# Altium project WarmAndFuzzy Thermostat.PrjPcb
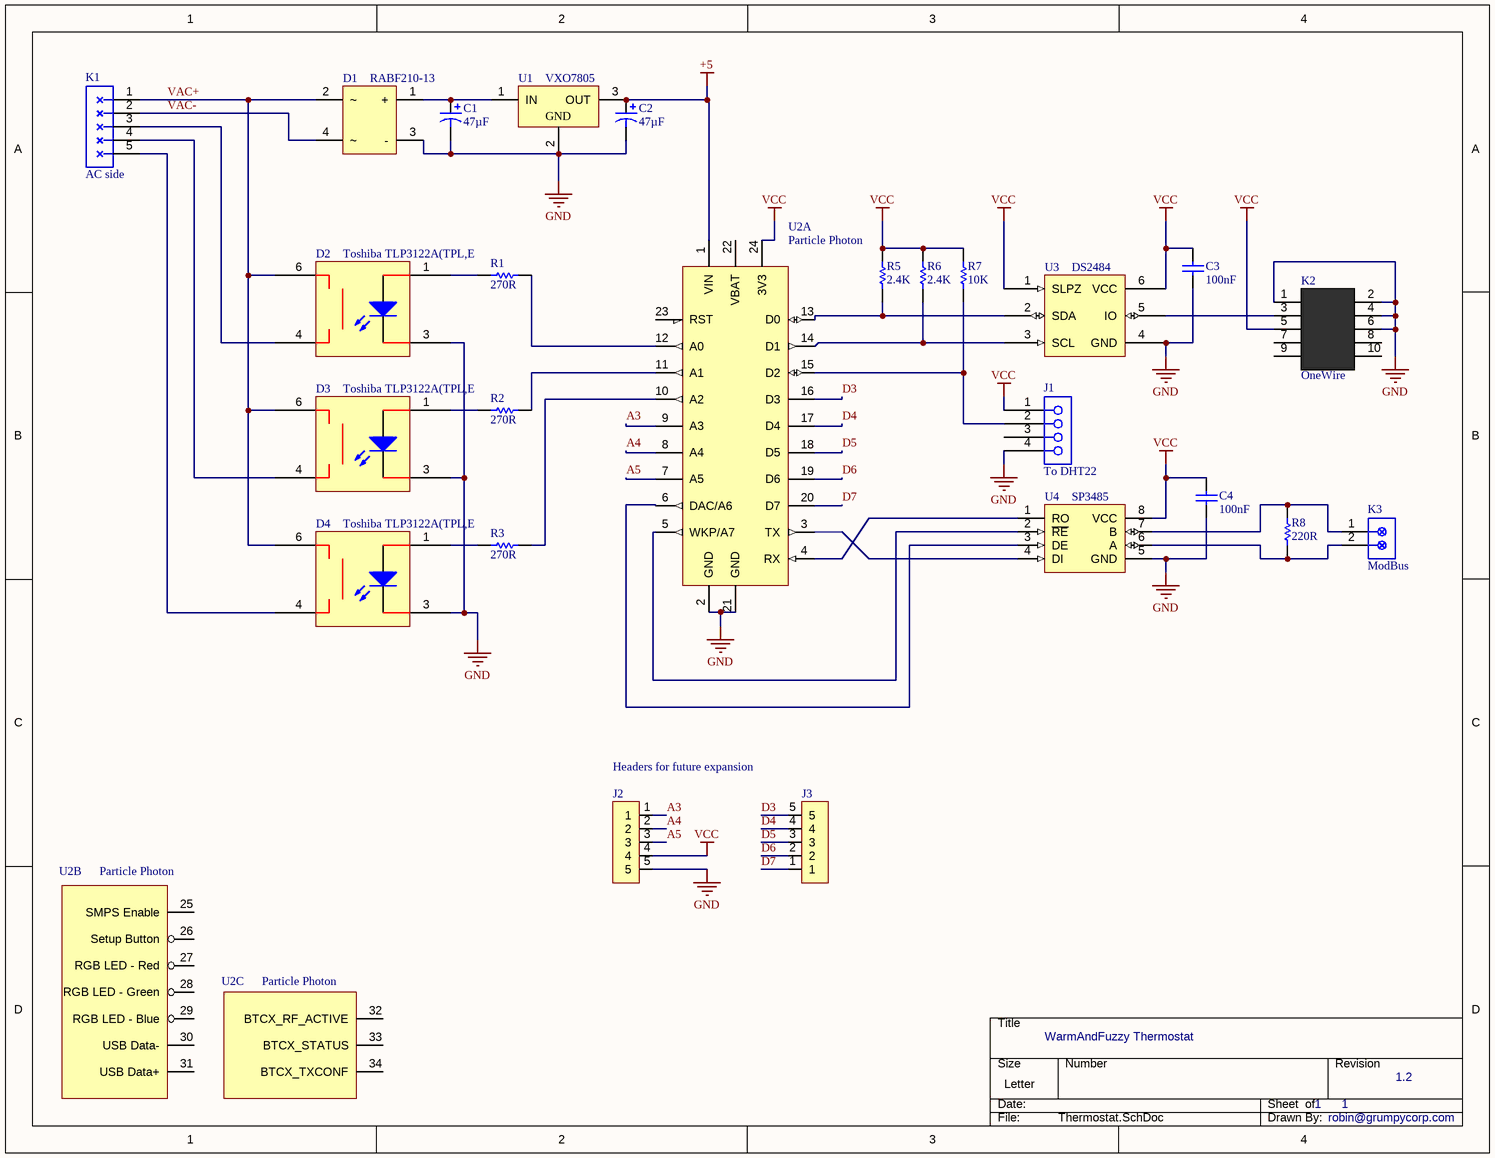
[diagram p0: Thermostat.SchDoc]
1 sheet, 25 parts. Net scope: global (net labels, ports and power ports of the same name join across sheets).

## Sheet Thermostat.SchDoc
size Letter

### Parts
C1  47µF  [ELCO-6.3-12-2.5]
C2  47µF  [ELCO-6.3-12-2.5]
C3  100nF  [PCB-57eb66w7n7cajp6rs5yy-1]
C4  100nF  [PCB-57eb66w7n7cajp6rs5yy-1]
D1  RABF210-13  [PCB-a4f1j7dljjmb9y4t2o4h-1]
D2  Toshiba TLP3122A(TPL,E  [PCBComponent_1]
D3  Toshiba TLP3122A(TPL,E  [PCBComponent_1]
D4  Toshiba TLP3122A(TPL,E  [PCBComponent_1]
J1  To DHT22  [PCB-rn7un5c8cc0swpp1289c-1]
J2  Future  [PCB-rnlen50cc5tt6vc22c1r-1]  (value not drawn)
J3  Future  [PCB-rnlen50cc5tt6vc22c1r-1]  (value not drawn)
K1  AC side  [PCB-pdjdo99g3kfsve06mxjg-1]
K2  OneWire  [PCB-aez6wowwcq4hxfvji4nz-1]
K3  ModBus  [PCBComponent_1]
R1  270R  [RESC2012X50N]
R2  270R  [RESC2012X50N]
R3  270R  [RESC2012X50N]
R5  2.4K  [RESC2013X70X40ML20T20]
R6  2.4K  [RESC2013X70X40ML20T20]
R7  10K  [PCB-7wrvqjq7seaxrusqyahf-1]
R8  220R  [PCB-iya84cdbm96dhb72y1ru-1]
U1  VXO7805  [TO220]
U2  Particle Photon  [PCBComponent_1 - duplicate]  (parts A,B,C of 3)
U3  DS2484  [SOP6]
U4  SP3485  [PCB-1k2z6ddivtd17xu2xxf0-1]

### Nets
+5: C2.1 U1.3(OUT) U2.1(VIN)
GND: C1.2 C2.2 C3.1 C4.1 D1.3(-) D2.3 D3.3 D4.3 J1.4 J2.5 K2.1 K2.2 K2.4 K2.6 U1.2(GND) U2.2(GND) U2.21(GND) U3.4(GND) U4.5(GND)
VCC: C3.2 C4.2 J1.1 J2.4 K2.5 R5.2 R6.2 R7.1 U2.24(3V3) U3.1(SLPZ) U3.6(VCC) U4.8(VCC)
A3: J2.1 U2.9(A3)
A4: J2.2 U2.8(A4)
A5: J2.3 U2.7(A5)
D3: J3.5 U2.16(D3)
D4: J3.4 U2.17(D4)
D5: J3.3 U2.18(D5)
D6: J3.2 U2.19(D6)
D7: J3.1 U2.20(D7)
VAC+: D1.2 D2.6 D3.6 D4.6 K1.1
VAC-: D1.4 K1.2
NetC1_1: C1.1 D1.1(+) U1.1(IN)
NetD2_1: D2.1 R1.1
NetD2_4: D2.4 K1.3
NetD3_1: D3.1 R2.1
NetD3_4: D3.4 K1.4
NetD4_1: D4.1 R3.1
NetD4_4: D4.4 K1.5
NetJ1_2: J1.2 R7.2 U2.15(D2)
NetK2_3: K2.3 U3.5(IO)
NetK3_1: K3.1 R8.2 U4.7(B)
NetK3_2: K3.2 R8.1 U4.6(A)
NetR1_2: R1.2 U2.12(A0)
NetR2_2: R2.2 U2.11(A1)
NetR3_2: R3.2 U2.10(A2)
NetR5_1: R5.1 U2.13(D0) U3.2(SDA)
NetR6_1: R6.1 U2.14(D1) U3.3(SCL)
NetU2_3: U2.3(TX) U4.4(DI)
NetU2_4: U2.4(RX) U4.1(RO)
NetU2_5: U2.5(WKP/A7) U4.2(~{RE})
NetU2_6: U2.6(DAC/A6) U4.3(DE)

Not connected (* = marked no-connect by the designer): D2 ?1(A) ?2(K); D3 ?1(A) ?2(K); D4 ?1(A) ?2(K); J1 3; K2 7 8 9 10; U2 22(VBAT) 23(RST) 25(SMPS_Enable) 26(Setup_Button) 27(RGB_LED_-_Red) 28(RGB_LED_-_Green) 29(RGB_LED_-_Blue) 30(USB_Data-) 31(USB_Data+) 32(BTCX_RF_ACTIVE) 33(BTCX_STATUS) 34(BTCX_TXCONF)

### Notes on the sheet
- Headers for future expansion
- WarmAndFuzzy Thermostat
- 1
- 1.2
- robin@grumpycorp.com

### Library data of the parts
C1 C2 = CMP-5ae993e06a1d852e-2: 47uF 63 V dc Aluminium Electrolytic Capacitor, VR Series 2000h 6.3 (Dia.) x 11mm; Manufacturer Part Number: UVR1J470MED; Voltage Rating (DC): 63.0 V; Lead-Free Status: Lead Free; Dielectric Material: Aluminum Electrolytic; Capacitance Tolerance: ±20%; Capacitance: 47.0 µF; Size-Length: 11.0 mm; Packaging: Bulk; Number of Pins: 2; Mounting Style: Through Hole; Size-Diameter: 6.30 mm; Octopart URL: http://octopart.com/uvr1j470med-nichicon-202130; Footprint: PCB-6l37f35bjtt3q1q8z5h2-1; RoHS: Compliant; OctopartID: 5ae993e06a1d852e; Size-Height: 11.0 mm
C3 C4 = CMP-7da2b1f9736fa265-1: Cap, Mlcc, X7r, 0.1Uf, 100V, 0805; Manufacturer Part Number: 885012207128; Capacitance Tolerance: ±10%; Octopart URL: https://octopart.com/885012207128-w%C3%BCrth+elektronik-89205675; Dielectric Characteristic: X7R; Capacitance: 100 nF; Voltage Rating (DC): 100 V; Operating Temperature: -55.0 °C (min); OctopartID: 7da2b1f9736fa265; RoHS: Compliant
D1 = CMP-b47278e240476bb5-3: Bridge Rectifier ABF/SOPA-4 Type; Manufacturer Part Number: RABF210-13; Lifecycle Status: Not Listed by Manufacturer; OctopartID: b47278e240476bb5; Octopart URL: https://octopart.com/rabf210-13-diodes+inc.-94032211
D2-D4 = CMP-0758cb201e08d89f-2: Relay Ssr 25MA 1.4V Dc-in Dc-out 4-PIN So T/r; Manufacturer Part Number: TLP3122A(TPL,E; Octopart URL: https://octopart.com/tlp3122a%28tpl%2Ce-toshiba-91372598; Footprint: PCB-npvj4ne9r0noqxf6t42e-1; OctopartID: 0758cb201e08d89f
J1 = CMP-64ffaf704303bb38-11: Conn Unshrouded Header HDR 4 POS 2.54mm Solder ST Thru-Hole
J2 J3 = CMP-b5d67e8662e76a11-19: MTA-100 5 Position Through-Hole Single Row Straight Wire to Board Header; Manufacturer Part Number: 3-644456-5; ELV Compliant: Compliant; Mounting Angle: 180 °; Number of Positions: 5; Voltage Rating (AC): 250 V; Gender: Male; Pin Pitch: 2.54 mm; Shrouded: No; Lead-Free Status: Lead Free; Housing Color: Natural; Size-Height: 2.54 mm; Size-Width: 2.34 mm; OctopartID: b5d67e8662e76a11; Lifecycle Status: Active; Orientation: Vertical; Packaging: Box, Bag; Octopart URL: http://octopart.com/3-644456-5-te+connectivity+%2F+amp-39514711; RoHS: Compliant; Number of Rows: 1; Contact Material: Copper Alloy; Mounting Style: Through Hole; Number of Contacts: 5; Contact Plating: Tin; Housing Material: Polyester; Flammability Rating: UL 94 V-0; Size-Length: 12.4 mm
K1 = CMP-bd1670afe21562d1-1: Series 1377 - 5.00 mm Horizontal Entry with Pressure Clamp WR-TBL, 5 pin; Manufacturer Part Number: 691137710005; Pin Pitch: 5.00 mm; Octopart URL: https://octopart.com/691137710005-w%C3%BCrth+elektronik-78871141; Mounting Style: Through Hole; Operating Temperature: 120 °C (max); Packaging: Box; Number of Pins: 5; OctopartID: bd1670afe21562d1
K2 = CMP-7037b818d660aff0-6: Conn Shrouded Header HDR 10 POS 2.54mm Solder ST Thru-Hole; Manufacturer: On Shore Technology; Manufacturer Part Number: 302-S101; Pitch: 0.1" (2.54mm); Lifecycle Status: Not Listed by Manufacturer; Mounting Style: Through Hole; Color: Black; Packaging: Tray; Octopart URL: https://octopart.com/302-s101-on+shore+technology-19235633; Number of Pins: 10; OctopartID: 7037b818d660aff0; Row Spacing: 0.1" (2.54mm); Number of Rows: 2
K3 = CMP-e1e12c58bed83e26-3: Series 1377 - 5.00 mm Horizontal Entry with Pressure Clamp WR-TBL, 2 pin; Manufacturer Part Number: 691137710002; Pin Pitch: 5.00 mm; Packaging: Box; Octopart URL: https://octopart.com/691137710002-w%C3%BCrth+elektronik-78871135; OctopartID: e1e12c58bed83e26; Number of Pins: 2; Operating Temperature: 120 °C (max)
R1-R3 = CMP-10770253-6: Thick film resistor; Manufacturer Part Number: CRCW0805270RFKEA; Resistance Tolerance: ±1%; Lead-Free Status: Lead Free; Voltage Rating (DC): 150.0 V; Case/Package (SI): 2012; Power Rating: 0.125 W; Resistance: 270.0 Ω; Size-Length: 0.002 m; Number of Pins: 2; Size-Height: 0.00045 m; OctopartID: 6f95a4ff717ab052; Size-Width: 0.00125 m; Case/Package: 0805; Octopart Url: https://octopart.com/crcw0805270rfkea-vishay-39861129; RoHS: Compliant; REACH SVHC Compliance: No SVHC; Mounting Style: Surface Mount
R5 R6 = CMP-3674929-2: Thick Film Resistors - SMD 0805 2.4Kohms 5% Tol; Manufacturer Part Number: ERJ-6GEYJ242V; Case/Package (SI): 2012; Lead-Free Status: Lead Free; Power Rating: 0.125 W; Resistance: 2400.0 Ω; Voltage Rating (DC): 150.0 V; Case/Package: 0805; Lifecycle Status: Not Listed by Manufacturer; Mounting Style: Surface Mount; Octopart Url: https://octopart.com/erj-6geyj242v-panasonic-55422956; OctopartID: 342afe6dbea0ebed; Packaging: Cut Tape (CT); REACH SVHC Compliance: No SVHC; Resistance Tolerance: ±5%; RoHS: Compliant; Size-Height: 0.0006 m; Size-Length: 0.002 m; Size-Width: 0.00125 m
R7 = CMP-ce7e062e016b11b9-3: Res Thin Film 0805 10K Ohm 0.1% 1/10W ±25ppm/°C Molded SMD SMD Paper T/R; Manufacturer Part Number: CPF0805B10KE; ELV Compliant: Compliant; Case/Package (SI): 2012; Power Rating: 100 mW; Resistance: 10.0 kΩ; OctopartID: ce7e062e016b11b9; Mounting Style: Surface Mount; RoHS: Compliant; Case/Package: 0805; Lifecycle Status: Active
R8 = CMP-3828968-6: Res Thick Film 0805 220 Ohm 1% 1/8W ±100ppm/°C Molded SMD SMD Paper T/R; Manufacturer Part Number: CRCW0805220RFKEA; Voltage Rating (DC): 150 V; Temperature Coefficient: -100 ppm/°C to 100 ppm/°C; Lead-Free Status: Lead Free; Power Rating: 125 mW; Resistance: 220 Ω; Case/Package (SI): 2012; Mounting Style: Surface Mount; Number of Pins: 2; RoHS: Compliant; Operating Temperature: 150 °C (max); Resistance Tolerance: ±1%; REACH SVHC Compliance: No SVHC; Case/Package: 0805; Packaging: Tape & Reel (TR), Reel, Cut Tape (CT); Size-Length: 2.00 mm; Octopart URL: https://octopart.com/crcw0805220rfkea-vishay-39786358; OctopartID: 7719bc4c4509a8de; Size-Width: 1.25 mm; Size-Height: 450 µm
U1 = CMP-591094eba19486d7-3: VXO78-1000 Series 24 / 12 Vin ±5 Vout Non-Isolated DC Switching Regulator; Manufacturer Part Number: VXO7805-1000; Lead-Free Status: Lead Free; Footprint: PCC-0031-00289-1; OctopartID: 591094eba19486d7; Octopart URL: http://octopart.com/vxo7805-1000-cui-82959842; RoHS: Compliant
U2 = CMP-bf527286d3196095-5: Particle Photon with Headers; OctopartID: bf527286d3196095; Octopart URL: http://octopart.com/photonh-particle-81676589
U3 = CMP-0ec0c6075a5bd107-2: Single Channel 1-Wire Master 6-Pin SOT-23 T/R; Manufacturer Part Number: DS2484R+T; Supply Voltage (DC): 1.71 V (min); Octopart URL: http://octopart.com/ds2484r%2Bt-maxim+integrated-30241277; OctopartID: 0ec0c6075a5bd107; Lifecycle Status: Active; Packaging: Cut Tape (CT); Number of Pins: 6; RoHS: Compliant; Data Sheet: https://datasheets.maximintegrated.com/en/ds/DS2484.pdf
U4 = CMP-69cfa0afed5fb608-2: SP3485 Series 10 Mbps 3.3 V Low Power Half Duplex RS-485 Transceiver - SOIC-8N; Manufacturer Part Number: SP3485EN-L; Output Current: 1.00 µA; Lead-Free Status: Lead Free; Supply Voltage (DC): 3.13 V (min); Data Rate: 10.0 Mbps; Supply Current: 1.00 mA; RoHS: Compliant; Octopart URL: http://octopart.com/sp3485en-l-exar-6988278; Mounting Style: Surface Mount; Packaging: Tube; Number of Pins: 8; OctopartID: 69cfa0afed5fb608